# Altium schematic sheet TPS65133_SingleChannel.SchDoc
size A4
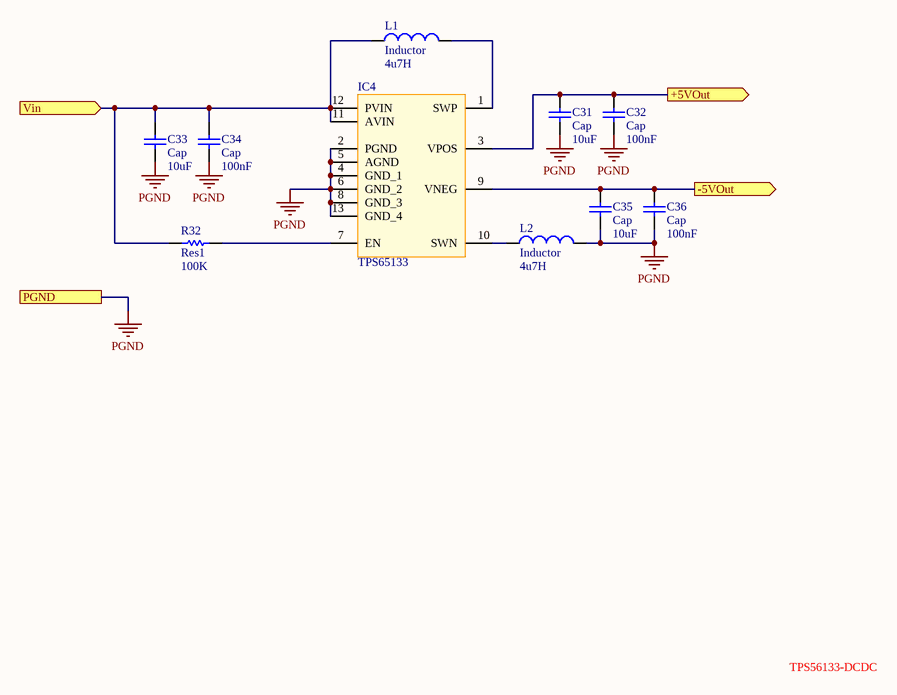
[diagram p0: TPS65133_SingleChannel.SchDoc]

## Parts
C31  Cap  value 10uF  [0603C]
C32  Cap  value 100nF  [0603C]
C33  Cap  value 10uF  [0603C]
C34  Cap  value 100nF  [0603C]
C35  Cap  value 10uF  [0603C]
C36  Cap  value 100nF  [0603C]
IC4  TPS65133  [SON45P300X300X80-13N-D]
L1  Inductor  value 4u7H  [0402-A]
L2  Inductor  value 4u7H  [0402-A]
R32  Res1  value 100K  [0603R]

## Ports
+5VOut (out), -5VOut (out), PGND, Vin (in)

## Nets
PGND: C31.1 C32.1 C33.1 C34.1 C35.1 C36.1 IC4.2(PGND) IC4.4(GND_1) IC4.5(AGND) IC4.6(GND_2) IC4.8(GND_3) IC4.13(GND_4) L2.2 ; port PGND
+5VOut: C31.2 C32.2 IC4.3(VPOS) ; port +5VOut
-5VOut: C35.2 C36.2 IC4.9(VNEG) ; port -5VOut
Vin: C33.2 C34.2 IC4.11(AVIN) IC4.12(PVIN) L1.1 R32.1 ; port Vin
NetIC4_1: IC4.1(SWP) L1.2
NetIC4_7: IC4.7(EN) R32.2
NetIC4_10: IC4.10(SWN) L2.1

## Notes on the sheet
- TPS56133-DCDC

## Library data of the parts
C31-C36 = Cap: Capacitor; Published: 8-Jun-2000; LatestRevisionDate: 17-Jul-2002; LatestRevisionNote: Re-released for DXP Platform.; PackageReference: RAD-0.3; Publisher: Altium Limited; PackageDescription: Radial Cap, Thru-Hole; 2 Leads; 0.3 in Pin Spacing
IC4 = TPS65133DPDR: ±5V，250mA 双输出DC-DC电源; Manufacturer_Name: Texas Instruments; Datasheet Link: http://www.ti.com/lit/ds/symlink/tps65133.pdf; Height: 0.8mm; Manufacturer_Part_Number: TPS65133DPDR; Mouser Part Number: 595-TPS65133DPDR; Mouser Price/Stock: https://www.mouser.co.uk/ProductDetail/Texas-Instruments/TPS65133DPDR?qs=7GxONfNUZSjxiorxR5wfmg%3D%3D; Arrow Part Number: TPS65133DPDR; Arrow Price/Stock: https://www.arrow.com/en/products/tps65133dpdr/texas-instruments?region=nac; ComponentLink1Description: TI官网; ComponentLink1URL: https://www.ti.com.cn/cn/lit/ds/symlink/tps65133.pdf?ts=1670145359710&ref_url=https%253A%252F%252Fwww.ti.com.cn%252Fproduct%252Fcn%252FTPS65133
L1 L2 = Inductor: Code_IEC: 1005; Published: 8-Jun-2000; LatestRevisionDate: 29-May-2009; LatestRevisionNote: IPC-7351 Footprint Added.; PackageReference: 0402-A; Publisher: Altium Limited; PackageDescription: Chip Inductor; Code_JEITA: 0402
R32 = Res1: Resistor; Published: 8-Jun-2000; LatestRevisionDate: 17-Jul-2002; LatestRevisionNote: Re-released for DXP Platform.; PackageReference: AXIAL-0.3; Publisher: Altium Limited; PackageDescription: Axial Device, Thru-Hole; 2 Leads; 0.3 in Pin Spacing